# EAGLE schematic picotouch_grid_mpr (EAGLE 9.6.2)

## Sheet 1 of 3
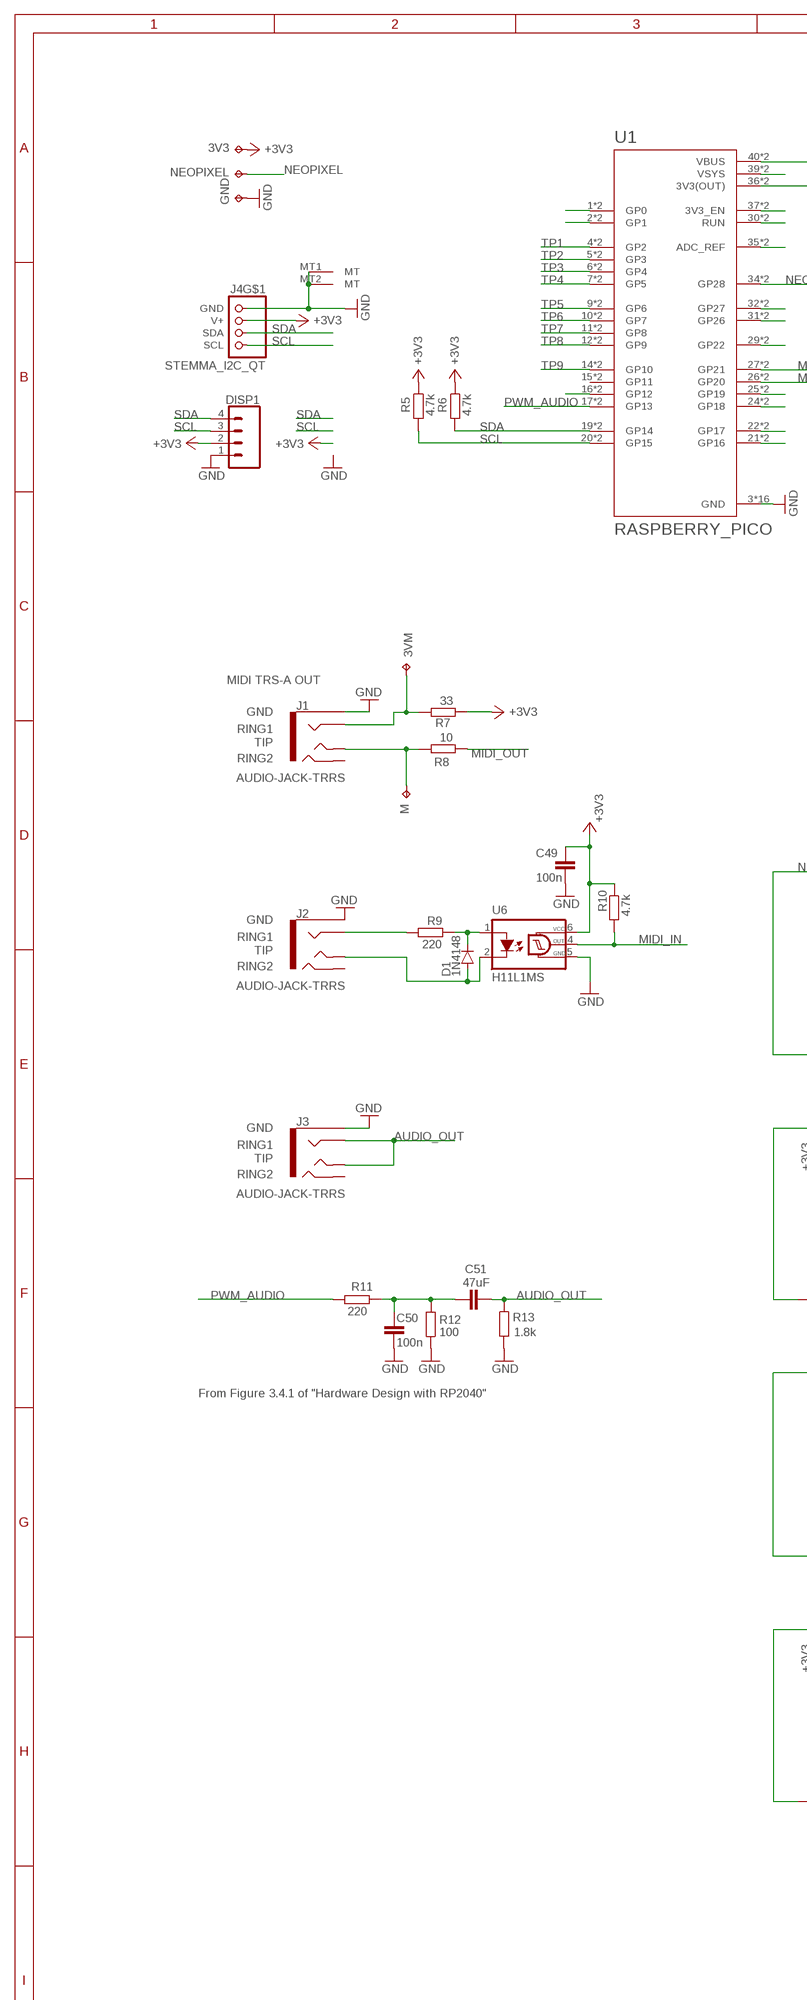
[diagram p0: schematic, sheet 1, part 1 of 2]
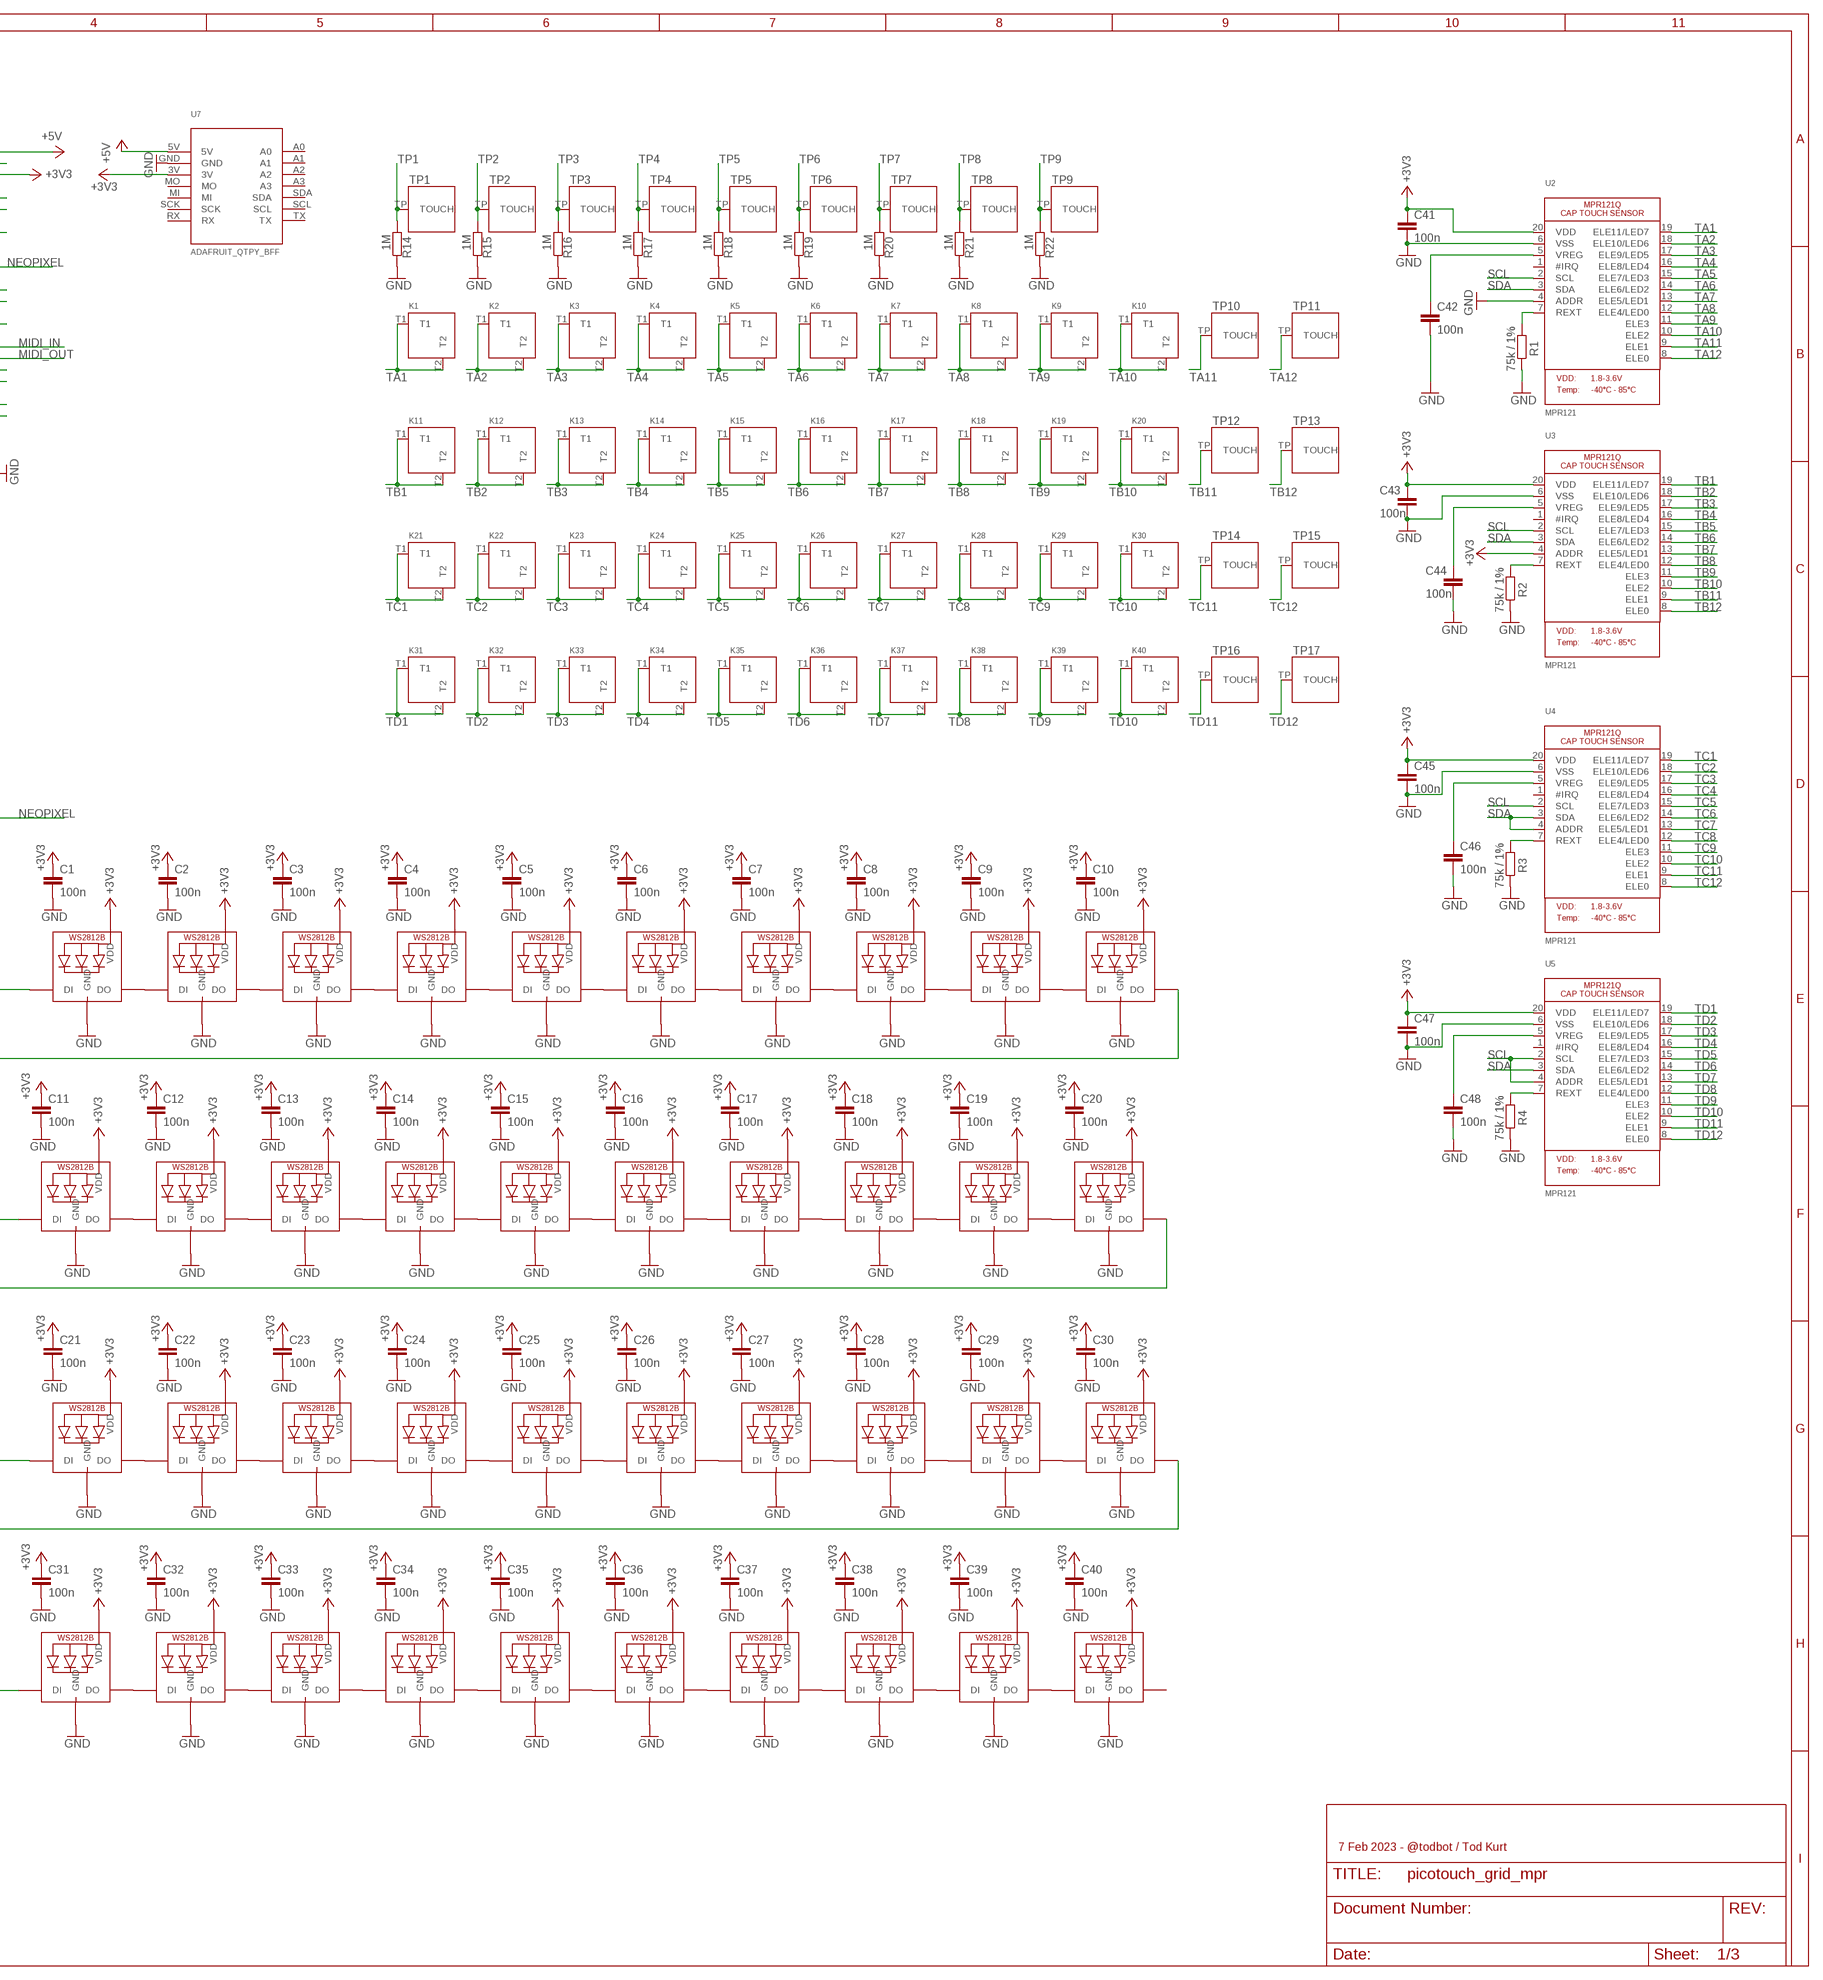
[diagram p1: schematic, sheet 1, part 2 of 2]

### Parts
3V3  TPTP15R  [TP15R]
3VM  TPTP15R  [TP15R]
C1  100n  C-EUC0603  [C0603]
C2  100n  C-EUC0603  [C0603]
C3  100n  C-EUC0603  [C0603]
C4  100n  C-EUC0603  [C0603]
C5  100n  C-EUC0603  [C0603]
C6  100n  C-EUC0603  [C0603]
C7  100n  C-EUC0603  [C0603]
C8  100n  C-EUC0603  [C0603]
C9  100n  C-EUC0603  [C0603]
C10  100n  C-EUC0603  [C0603]
C11  100n  C-EUC0603  [C0603]
C12  100n  C-EUC0603  [C0603]
C13  100n  C-EUC0603  [C0603]
C14  100n  C-EUC0603  [C0603]
C15  100n  C-EUC0603  [C0603]
C16  100n  C-EUC0603  [C0603]
C17  100n  C-EUC0603  [C0603]
C18  100n  C-EUC0603  [C0603]
C19  100n  C-EUC0603  [C0603]
C20  100n  C-EUC0603  [C0603]
C21  100n  C-EUC0603  [C0603]
C22  100n  C-EUC0603  [C0603]
C23  100n  C-EUC0603  [C0603]
C24  100n  C-EUC0603  [C0603]
C25  100n  C-EUC0603  [C0603]
C26  100n  C-EUC0603  [C0603]
C27  100n  C-EUC0603  [C0603]
C28  100n  C-EUC0603  [C0603]
C29  100n  C-EUC0603  [C0603]
C30  100n  C-EUC0603  [C0603]
C31  100n  C-EUC0603  [C0603]
C32  100n  C-EUC0603  [C0603]
C33  100n  C-EUC0603  [C0603]
C34  100n  C-EUC0603  [C0603]
C35  100n  C-EUC0603  [C0603]
C36  100n  C-EUC0603  [C0603]
C37  100n  C-EUC0603  [C0603]
C38  100n  C-EUC0603  [C0603]
C39  100n  C-EUC0603  [C0603]
C40  100n  C-EUC0603  [C0603]
C41  100n  C-EUC0603  [C0603]
C42  100n  C-EUC0603  [C0603]
C43  100n  C-EUC0603  [C0603]
C44  100n  C-EUC0603  [C0603]
C45  100n  C-EUC0603  [C0603]
C46  100n  C-EUC0603  [C0603]
C47  100n  C-EUC0603  [C0603]
C48  100n  C-EUC0603  [C0603]
C49  100n  C-EUC0603  [C0603]
C50  100n  C-EUC0603  [C0603]
C51  47uF  C-EUC0805  [C0805]
D1  1N4148  DIODE-SOD123  [SOD123]
DISP1  CONN_04  [1X04]
GND  TPTP15R  [TP15R]
J1  AUDIO-JACK-TRRS  [PJ-320D_SPARKFUN]
J2  AUDIO-JACK-TRRS  [PJ-320D_SPARKFUN]
J3  AUDIO-JACK-TRRS  [PJ-320D_SPARKFUN]
J4  STEMMA_I2C_QT  [JST_SH4]
K1  TOUCHKEYH  [TOUCHPAD_KEY_0.5IN_LEDHOLE]
K2  TOUCHKEYH  [TOUCHPAD_KEY_0.5IN_LEDHOLE]
K3  TOUCHKEYH  [TOUCHPAD_KEY_0.5IN_LEDHOLE]
K4  TOUCHKEYH  [TOUCHPAD_KEY_0.5IN_LEDHOLE]
K5  TOUCHKEYH  [TOUCHPAD_KEY_0.5IN_LEDHOLE]
K6  TOUCHKEYH  [TOUCHPAD_KEY_0.5IN_LEDHOLE]
K7  TOUCHKEYH  [TOUCHPAD_KEY_0.5IN_LEDHOLE]
K8  TOUCHKEYH  [TOUCHPAD_KEY_0.5IN_LEDHOLE]
K9  TOUCHKEYH  [TOUCHPAD_KEY_0.5IN_LEDHOLE]
K10  TOUCHKEYH  [TOUCHPAD_KEY_0.5IN_LEDHOLE]
K11  TOUCHKEYH  [TOUCHPAD_KEY_0.5IN_LEDHOLE]
K12  TOUCHKEYH  [TOUCHPAD_KEY_0.5IN_LEDHOLE]
K13  TOUCHKEYH  [TOUCHPAD_KEY_0.5IN_LEDHOLE]
K14  TOUCHKEYH  [TOUCHPAD_KEY_0.5IN_LEDHOLE]
K15  TOUCHKEYH  [TOUCHPAD_KEY_0.5IN_LEDHOLE]
K16  TOUCHKEYH  [TOUCHPAD_KEY_0.5IN_LEDHOLE]
K17  TOUCHKEYH  [TOUCHPAD_KEY_0.5IN_LEDHOLE]
K18  TOUCHKEYH  [TOUCHPAD_KEY_0.5IN_LEDHOLE]
K19  TOUCHKEYH  [TOUCHPAD_KEY_0.5IN_LEDHOLE]
K20  TOUCHKEYH  [TOUCHPAD_KEY_0.5IN_LEDHOLE]
K21  TOUCHKEYH  [TOUCHPAD_KEY_0.5IN_LEDHOLE]
K22  TOUCHKEYH  [TOUCHPAD_KEY_0.5IN_LEDHOLE]
K23  TOUCHKEYH  [TOUCHPAD_KEY_0.5IN_LEDHOLE]
K24  TOUCHKEYH  [TOUCHPAD_KEY_0.5IN_LEDHOLE]
K25  TOUCHKEYH  [TOUCHPAD_KEY_0.5IN_LEDHOLE]
K26  TOUCHKEYH  [TOUCHPAD_KEY_0.5IN_LEDHOLE]
K27  TOUCHKEYH  [TOUCHPAD_KEY_0.5IN_LEDHOLE]
K28  TOUCHKEYH  [TOUCHPAD_KEY_0.5IN_LEDHOLE]
K29  TOUCHKEYH  [TOUCHPAD_KEY_0.5IN_LEDHOLE]
K30  TOUCHKEYH  [TOUCHPAD_KEY_0.5IN_LEDHOLE]
K31  TOUCHKEYH  [TOUCHPAD_KEY_0.5IN_LEDHOLE]
K32  TOUCHKEYH  [TOUCHPAD_KEY_0.5IN_LEDHOLE]
K33  TOUCHKEYH  [TOUCHPAD_KEY_0.5IN_LEDHOLE]
K34  TOUCHKEYH  [TOUCHPAD_KEY_0.5IN_LEDHOLE]
K35  TOUCHKEYH  [TOUCHPAD_KEY_0.5IN_LEDHOLE]
K36  TOUCHKEYH  [TOUCHPAD_KEY_0.5IN_LEDHOLE]
K37  TOUCHKEYH  [TOUCHPAD_KEY_0.5IN_LEDHOLE]
K38  TOUCHKEYH  [TOUCHPAD_KEY_0.5IN_LEDHOLE]
K39  TOUCHKEYH  [TOUCHPAD_KEY_0.5IN_LEDHOLE]
K40  TOUCHKEYH  [TOUCHPAD_KEY_0.5IN_LEDHOLE]
LED1  MICROBUILDER_WS2812B_SK6812E  [MICROBUILDER_NEO3535_REVERSE]
LED2  MICROBUILDER_WS2812B_SK6812E  [MICROBUILDER_NEO3535_REVERSE]
LED3  MICROBUILDER_WS2812B_SK6812E  [MICROBUILDER_NEO3535_REVERSE]
LED4  MICROBUILDER_WS2812B_SK6812E  [MICROBUILDER_NEO3535_REVERSE]
LED5  MICROBUILDER_WS2812B_SK6812E  [MICROBUILDER_NEO3535_REVERSE]
LED6  MICROBUILDER_WS2812B_SK6812E  [MICROBUILDER_NEO3535_REVERSE]
LED7  MICROBUILDER_WS2812B_SK6812E  [MICROBUILDER_NEO3535_REVERSE]
LED8  MICROBUILDER_WS2812B_SK6812E  [MICROBUILDER_NEO3535_REVERSE]
LED9  MICROBUILDER_WS2812B_SK6812E  [MICROBUILDER_NEO3535_REVERSE]
LED10  MICROBUILDER_WS2812B_SK6812E  [MICROBUILDER_NEO3535_REVERSE]
LED11  MICROBUILDER_WS2812B_SK6812E  [MICROBUILDER_NEO3535_REVERSE]
LED12  MICROBUILDER_WS2812B_SK6812E  [MICROBUILDER_NEO3535_REVERSE]
LED13  MICROBUILDER_WS2812B_SK6812E  [MICROBUILDER_NEO3535_REVERSE]
LED14  MICROBUILDER_WS2812B_SK6812E  [MICROBUILDER_NEO3535_REVERSE]
LED15  MICROBUILDER_WS2812B_SK6812E  [MICROBUILDER_NEO3535_REVERSE]
LED16  MICROBUILDER_WS2812B_SK6812E  [MICROBUILDER_NEO3535_REVERSE]
LED17  MICROBUILDER_WS2812B_SK6812E  [MICROBUILDER_NEO3535_REVERSE]
LED18  MICROBUILDER_WS2812B_SK6812E  [MICROBUILDER_NEO3535_REVERSE]
LED19  MICROBUILDER_WS2812B_SK6812E  [MICROBUILDER_NEO3535_REVERSE]
LED20  MICROBUILDER_WS2812B_SK6812E  [MICROBUILDER_NEO3535_REVERSE]
LED21  MICROBUILDER_WS2812B_SK6812E  [MICROBUILDER_NEO3535_REVERSE]
LED22  MICROBUILDER_WS2812B_SK6812E  [MICROBUILDER_NEO3535_REVERSE]
LED23  MICROBUILDER_WS2812B_SK6812E  [MICROBUILDER_NEO3535_REVERSE]
LED24  MICROBUILDER_WS2812B_SK6812E  [MICROBUILDER_NEO3535_REVERSE]
LED25  MICROBUILDER_WS2812B_SK6812E  [MICROBUILDER_NEO3535_REVERSE]
LED26  MICROBUILDER_WS2812B_SK6812E  [MICROBUILDER_NEO3535_REVERSE]
LED27  MICROBUILDER_WS2812B_SK6812E  [MICROBUILDER_NEO3535_REVERSE]
LED28  MICROBUILDER_WS2812B_SK6812E  [MICROBUILDER_NEO3535_REVERSE]
LED29  MICROBUILDER_WS2812B_SK6812E  [MICROBUILDER_NEO3535_REVERSE]
LED30  MICROBUILDER_WS2812B_SK6812E  [MICROBUILDER_NEO3535_REVERSE]
LED31  MICROBUILDER_WS2812B_SK6812E  [MICROBUILDER_NEO3535_REVERSE]
LED32  MICROBUILDER_WS2812B_SK6812E  [MICROBUILDER_NEO3535_REVERSE]
LED33  MICROBUILDER_WS2812B_SK6812E  [MICROBUILDER_NEO3535_REVERSE]
LED34  MICROBUILDER_WS2812B_SK6812E  [MICROBUILDER_NEO3535_REVERSE]
LED35  MICROBUILDER_WS2812B_SK6812E  [MICROBUILDER_NEO3535_REVERSE]
LED36  MICROBUILDER_WS2812B_SK6812E  [MICROBUILDER_NEO3535_REVERSE]
LED37  MICROBUILDER_WS2812B_SK6812E  [MICROBUILDER_NEO3535_REVERSE]
LED38  MICROBUILDER_WS2812B_SK6812E  [MICROBUILDER_NEO3535_REVERSE]
LED39  MICROBUILDER_WS2812B_SK6812E  [MICROBUILDER_NEO3535_REVERSE]
LED40  MICROBUILDER_WS2812B_SK6812E  [MICROBUILDER_NEO3535_REVERSE]
M  TPTP15R  [TP15R]
NEOPIXEL  TPTP15R  [TP15R]
R1  75k / 1%  R-EU_R0603  [R0603]
R2  75k / 1%  R-EU_R0603  [R0603]
R3  75k / 1%  R-EU_R0603  [R0603]
R4  75k / 1%  R-EU_R0603  [R0603]
R5  4.7k  R-EU_R0603  [R0603]
R6  4.7k  R-EU_R0603  [R0603]
R7  33  R-EU_R0603  [R0603]
R8  10  R-EU_R0603  [R0603]
R9  220  R-EU_R0603  [R0603]
R10  4.7k  R-EU_R0603  [R0603]
R11  220  R-EU_R0603  [R0603]
R12  100  R-EU_R0603  [R0603]
R13  1.8k  R-EU_R0603  [R0603]
R14  1M  R-EU_R0603  [R0603]
R15  1M  R-EU_R0603  [R0603]
R16  1M  R-EU_R0603  [R0603]
R17  1M  R-EU_R0603  [R0603]
R18  1M  R-EU_R0603  [R0603]
R19  1M  R-EU_R0603  [R0603]
R20  1M  R-EU_R0603  [R0603]
R21  1M  R-EU_R0603  [R0603]
R22  1M  R-EU_R0603  [R0603]
TP1  TOUCHPADB  [TOUCHPADB]
TP2  TOUCHPADB  [TOUCHPADB]
TP3  TOUCHPADB  [TOUCHPADB]
TP4  TOUCHPADB  [TOUCHPADB]
TP5  TOUCHPADB  [TOUCHPADB]
TP6  TOUCHPADB  [TOUCHPADB]
TP7  TOUCHPADB  [TOUCHPADB]
TP8  TOUCHPADB  [TOUCHPADB]
TP9  TOUCHPADB  [TOUCHPADB]
TP10  TOUCHPADB  [TOUCHPADB]
TP11  TOUCHPADB  [TOUCHPADB]
TP12  TOUCHPADB  [TOUCHPADB]
TP13  TOUCHPADB  [TOUCHPADB]
TP14  TOUCHPADB  [TOUCHPADB]
TP15  TOUCHPADB  [TOUCHPADB]
TP16  TOUCHPADB  [TOUCHPADB]
TP17  TOUCHPADB  [TOUCHPADB]
U1  RASPBERRY_PICO  [PICO-PKG-DUALSMD]
U2  MPR121  MPR121Q  [QFN20_3MM_NOTHERMAL]
U3  MPR121  MPR121Q  [QFN20_3MM_NOTHERMAL]
U4  MPR121  MPR121Q  [QFN20_3MM_NOTHERMAL]
U5  MPR121  MPR121Q  [QFN20_3MM_NOTHERMAL]
U6  H11L1MS  [DIL6-SMD]
U7  ADAFRUIT_QTPY_BFF  [ADAFRUIT_QTPY_BFF_LIPO]

### Nets
+3V3: 3V3.TP C1.1 C2.1 C3.1 C4.1 C5.1 C6.1 C7.1 C8.1 C9.1 C10.1 C11.1 C12.1 C13.1 C14.1 C15.1 C16.1 C17.1 C18.1 C19.1 C20.1 C21.1 C22.1 C23.1 C24.1 C25.1 C26.1 C27.1 C28.1 C29.1 C30.1 C31.1 C32.1 C33.1 C34.1 C35.1 C36.1 C37.1 C38.1 C39.1 C40.1 C41.1 C43.1 C45.1 C47.1 C49.1 DISP1.2 J4.2(V+) LED1.1-VDD(VDD) LED2.1-VDD(VDD) LED3.1-VDD(VDD) LED4.1-VDD(VDD) LED5.1-VDD(VDD) LED6.1-VDD(VDD) LED7.1-VDD(VDD) LED8.1-VDD(VDD) LED9.1-VDD(VDD) LED10.1-VDD(VDD) LED11.1-VDD(VDD) LED12.1-VDD(VDD) LED13.1-VDD(VDD) LED14.1-VDD(VDD) LED15.1-VDD(VDD) LED16.1-VDD(VDD) LED17.1-VDD(VDD) LED18.1-VDD(VDD) LED19.1-VDD(VDD) LED20.1-VDD(VDD) LED21.1-VDD(VDD) LED22.1-VDD(VDD) LED23.1-VDD(VDD) LED24.1-VDD(VDD) LED25.1-VDD(VDD) LED26.1-VDD(VDD) LED27.1-VDD(VDD) LED28.1-VDD(VDD) LED29.1-VDD(VDD) LED30.1-VDD(VDD) LED31.1-VDD(VDD) LED32.1-VDD(VDD) LED33.1-VDD(VDD) LED34.1-VDD(VDD) LED35.1-VDD(VDD) LED36.1-VDD(VDD) LED37.1-VDD(VDD) LED38.1-VDD(VDD) LED39.1-VDD(VDD) LED40.1-VDD(VDD) R5.1 R6.1 R7.2 R10.1 U1.36'(3V3(OUT)) U1.36(3V3(OUT)) U2.20(VDD) U3.4(ADDR) U3.20(VDD) U4.20(VDD) U5.20(VDD) U6.6(VCC) U7.3V
+5V: U1.40'(VBUS) U1.40(VBUS) U7.5V
AUDIO_OUT: C51.2 J3.RING1 J3.TIP R13.1
GND: C1.2 C2.2 C3.2 C4.2 C5.2 C6.2 C7.2 C8.2 C9.2 C10.2 C11.2 C12.2 C13.2 C14.2 C15.2 C16.2 C17.2 C18.2 C19.2 C20.2 C21.2 C22.2 C23.2 C24.2 C25.2 C26.2 C27.2 C28.2 C29.2 C30.2 C31.2 C32.2 C33.2 C34.2 C35.2 C36.2 C37.2 C38.2 C39.2 C40.2 C41.2 C42.2 C43.2 C44.2 C45.2 C46.2 C47.2 C48.2 C49.2 C50.2 DISP1.1 GND.TP J1.EARTH J2.EARTH J3.EARTH J4.1(GND) J4.MT1(MT) J4.MT2(MT) LED1.3-GND(GND) LED2.3-GND(GND) LED3.3-GND(GND) LED4.3-GND(GND) LED5.3-GND(GND) LED6.3-GND(GND) LED7.3-GND(GND) LED8.3-GND(GND) LED9.3-GND(GND) LED10.3-GND(GND) LED11.3-GND(GND) LED12.3-GND(GND) LED13.3-GND(GND) LED14.3-GND(GND) LED15.3-GND(GND) LED16.3-GND(GND) LED17.3-GND(GND) LED18.3-GND(GND) LED19.3-GND(GND) LED20.3-GND(GND) LED21.3-GND(GND) LED22.3-GND(GND) LED23.3-GND(GND) LED24.3-GND(GND) LED25.3-GND(GND) LED26.3-GND(GND) LED27.3-GND(GND) LED28.3-GND(GND) LED29.3-GND(GND) LED30.3-GND(GND) LED31.3-GND(GND) LED32.3-GND(GND) LED33.3-GND(GND) LED34.3-GND(GND) LED35.3-GND(GND) LED36.3-GND(GND) LED37.3-GND(GND) LED38.3-GND(GND) LED39.3-GND(GND) LED40.3-GND(GND) R1.1 R2.1 R3.1 R4.1 R12.1 R13.2 R14.1 R15.1 R16.1 R17.1 R18.1 R19.1 R20.1 R21.1 R22.1 U1.3'(GND) U1.3(GND) U1.8'(GND) U1.8(GND) U1.13'(GND) U1.13(GND) U1.18'(GND) U1.18(GND) U1.23'(GND) U1.23(GND) U1.28'(GND) U1.28(GND) U1.33'(GND) U1.33(GND) U1.38'(GND) U1.38(GND) U2.4(ADDR) U2.6(VSS) U3.6(VSS) U4.6(VSS) U5.6(VSS) U6.5(GND) U7.GND
MIDI_IN: R10.2 U1.27'(GP21) U1.27(GP21) U6.4(OUT)
MIDI_OUT: R8.2 U1.26'(GP20) U1.26(GP20)
N$1: LED1.2-DOUT(DO) LED2.4-DIN(DI)
N$2: LED2.2-DOUT(DO) LED3.4-DIN(DI)
N$3: LED4.2-DOUT(DO) LED5.4-DIN(DI)
N$4: LED5.2-DOUT(DO) LED6.4-DIN(DI)
N$5: LED3.2-DOUT(DO) LED4.4-DIN(DI)
N$6: LED7.2-DOUT(DO) LED8.4-DIN(DI)
N$7: LED8.2-DOUT(DO) LED9.4-DIN(DI)
N$8: J1.TIP M.TP R8.1
N$9: LED11.2-DOUT(DO) LED12.4-DIN(DI)
N$10: LED9.2-DOUT(DO) LED10.4-DIN(DI)
N$11: LED6.2-DOUT(DO) LED7.4-DIN(DI)
N$12: LED14.2-DOUT(DO) LED15.4-DIN(DI)
N$13: LED15.2-DOUT(DO) LED16.4-DIN(DI)
N$14: LED13.2-DOUT(DO) LED14.4-DIN(DI)
N$15: LED17.2-DOUT(DO) LED18.4-DIN(DI)
N$16: LED18.2-DOUT(DO) LED19.4-DIN(DI)
N$17: LED19.2-DOUT(DO) LED20.4-DIN(DI)
N$18: LED16.2-DOUT(DO) LED17.4-DIN(DI)
N$19: LED12.2-DOUT(DO) LED13.4-DIN(DI)
N$20: LED21.2-DOUT(DO) LED22.4-DIN(DI)
N$21: LED22.2-DOUT(DO) LED23.4-DIN(DI)
N$22: LED24.2-DOUT(DO) LED25.4-DIN(DI)
N$23: LED25.2-DOUT(DO) LED26.4-DIN(DI)
N$24: LED23.2-DOUT(DO) LED24.4-DIN(DI)
N$25: LED27.2-DOUT(DO) LED28.4-DIN(DI)
N$26: LED28.2-DOUT(DO) LED29.4-DIN(DI)
N$27: LED31.2-DOUT(DO) LED32.4-DIN(DI)
N$28: LED29.2-DOUT(DO) LED30.4-DIN(DI)
N$29: LED26.2-DOUT(DO) LED27.4-DIN(DI)
N$30: LED34.2-DOUT(DO) LED35.4-DIN(DI)
N$31: LED35.2-DOUT(DO) LED36.4-DIN(DI)
N$32: LED33.2-DOUT(DO) LED34.4-DIN(DI)
N$33: LED37.2-DOUT(DO) LED38.4-DIN(DI)
N$34: LED38.2-DOUT(DO) LED39.4-DIN(DI)
N$35: LED39.2-DOUT(DO) LED40.4-DIN(DI)
N$36: LED36.2-DOUT(DO) LED37.4-DIN(DI)
N$37: LED32.2-DOUT(DO) LED33.4-DIN(DI)
N$38: 3VM.TP J1.RING1 R7.1
N$39: U1.21'(GP16) U1.21(GP16)
N$40: U1.22'(GP17) U1.22(GP17)
N$41: U1.24'(GP18) U1.24(GP18)
N$42: U1.25'(GP19) U1.25(GP19)
N$43: R2.2 U3.7(REXT)
N$44: C44.1 U3.5(VREG)
N$45: U1.32'(GP27) U1.32(GP27)
N$47: D1.C R9.1 U6.1(A)
N$48: D1.A J2.TIP U6.2(C)
N$49: J2.RING1 R9.2
N$50: R4.2 U5.7(REXT)
N$51: C48.1 U5.5(VREG)
N$53: U1.31'(GP26) U1.31(GP26)
N$54: U1.29'(GP22) U1.29(GP22)
N$55: U1.35'(ADC_REF) U1.35(ADC_REF)
N$56: U1.30'(RUN) U1.30(RUN)
N$57: C50.1 C51.1 R11.1 R12.2
N$58: U1.37'(3V3_EN) U1.37(3V3_EN)
N$61: U1.2'(GP1) U1.2(GP1)
N$62: R3.2 U4.7(REXT)
N$63: C46.1 U4.5(VREG)
N$64: U1.1'(GP0) U1.1(GP0)
N$66: U1.39'(VSYS) U1.39(VSYS)
N$67: U1.16'(GP12) U1.16(GP12)
N$114: C42.1 U2.5(VREG)
N$115: R1.2 U2.7(REXT)
NEOPIXEL: LED1.4-DIN(DI) NEOPIXEL.TP U1.34'(GP28) U1.34(GP28)
NEOPIXEL0: LED10.2-DOUT(DO) LED11.4-DIN(DI)
NEOPIXEL1: LED20.2-DOUT(DO) LED21.4-DIN(DI)
NEOPIXEL2: LED30.2-DOUT(DO) LED31.4-DIN(DI)
PWM_AUDIO: R11.2 U1.17'(GP13) U1.17(GP13)
SCL: DISP1.3 J4.4(SCL) R5.2 U1.20'(GP15) U1.20(GP15) U2.2(SCL) U3.2(SCL) U4.2(SCL) U5.2(SCL) U5.4(ADDR)
SDA: DISP1.4 J4.3(SDA) R6.2 U1.19'(GP14) U1.19(GP14) U2.3(SDA) U3.3(SDA) U4.3(SDA) U4.4(ADDR) U5.3(SDA)
TA1: K1.T1 K1.T2 U2.19(ELE11/LED7)
TA2: K2.T1 K2.T2 U2.18(ELE10/LED6)
TA3: K3.T1 K3.T2 U2.17(ELE9/LED5)
TA4: K4.T1 K4.T2 U2.16(ELE8/LED4)
TA5: K5.T1 K5.T2 U2.15(ELE7/LED3)
TA6: K6.T1 K6.T2 U2.14(ELE6/LED2)
TA7: K7.T1 K7.T2 U2.13(ELE5/LED1)
TA8: K8.T1 K8.T2 U2.12(ELE4/LED0)
TA9: K9.T1 K9.T2 U2.11(ELE3)
TA10: K10.T1 K10.T2 U2.10(ELE2)
TA11: TP10.TP(TOUCH) U2.9(ELE1)
TA12: TP11.TP(TOUCH) U2.8(ELE0)
TB1: K11.T1 K11.T2 U3.19(ELE11/LED7)
TB2: K12.T1 K12.T2 U3.18(ELE10/LED6)
TB3: K13.T1 K13.T2 U3.17(ELE9/LED5)
TB4: K14.T1 K14.T2 U3.16(ELE8/LED4)
TB5: K15.T1 K15.T2 U3.15(ELE7/LED3)
TB6: K16.T1 K16.T2 U3.14(ELE6/LED2)
TB7: K17.T1 K17.T2 U3.13(ELE5/LED1)
TB8: K18.T1 K18.T2 U3.12(ELE4/LED0)
TB9: K19.T1 K19.T2 U3.11(ELE3)
TB10: K20.T1 K20.T2 U3.10(ELE2)
TB11: TP12.TP(TOUCH) U3.9(ELE1)
TB12: TP13.TP(TOUCH) U3.8(ELE0)
TC1: K21.T1 K21.T2 U4.19(ELE11/LED7)
TC2: K22.T1 K22.T2 U4.18(ELE10/LED6)
TC3: K23.T1 K23.T2 U4.17(ELE9/LED5)
TC4: K24.T1 K24.T2 U4.16(ELE8/LED4)
TC5: K25.T1 K25.T2 U4.15(ELE7/LED3)
TC6: K26.T1 K26.T2 U4.14(ELE6/LED2)
TC7: K27.T1 K27.T2 U4.13(ELE5/LED1)
TC8: K28.T1 K28.T2 U4.12(ELE4/LED0)
TC9: K29.T1 K29.T2 U4.11(ELE3)
TC10: K30.T1 K30.T2 U4.10(ELE2)
TC11: TP14.TP(TOUCH) U4.9(ELE1)
TC12: TP15.TP(TOUCH) U4.8(ELE0)
TD1: K31.T1 K31.T2 U5.19(ELE11/LED7)
TD2: K32.T1 K32.T2 U5.18(ELE10/LED6)
TD3: K33.T1 K33.T2 U5.17(ELE9/LED5)
TD4: K34.T1 K34.T2 U5.16(ELE8/LED4)
TD5: K35.T1 K35.T2 U5.15(ELE7/LED3)
TD6: K36.T1 K36.T2 U5.14(ELE6/LED2)
TD7: K37.T1 K37.T2 U5.13(ELE5/LED1)
TD8: K38.T1 K38.T2 U5.12(ELE4/LED0)
TD9: K39.T1 K39.T2 U5.11(ELE3)
TD10: K40.T1 K40.T2 U5.10(ELE2)
TD11: TP16.TP(TOUCH) U5.9(ELE1)
TD12: TP17.TP(TOUCH) U5.8(ELE0)
TP1: R14.2 TP1.TP(TOUCH) U1.4'(GP2) U1.4(GP2)
TP2: R15.2 TP2.TP(TOUCH) U1.5'(GP3) U1.5(GP3)
TP3: R16.2 TP3.TP(TOUCH) U1.6'(GP4) U1.6(GP4)
TP4: R17.2 TP4.TP(TOUCH) U1.7'(GP5) U1.7(GP5)
TP5: R18.2 TP5.TP(TOUCH) U1.9'(GP6) U1.9(GP6)
TP6: R19.2 TP6.TP(TOUCH) U1.10'(GP7) U1.10(GP7)
TP7: R20.2 TP7.TP(TOUCH) U1.11'(GP8) U1.11(GP8)
TP8: R21.2 TP8.TP(TOUCH) U1.12'(GP9) U1.12(GP9)
TP9: R22.2 TP9.TP(TOUCH) U1.14'(GP10) U1.14(GP10)
Unconnected: J1.RING2 J2.RING2 J3.RING2 LED40.2-DOUT(DO) U1.15'(GP11) U1.15(GP11) U2.1(#IRQ) U3.1(#IRQ) U4.1(#IRQ) U5.1(#IRQ) U7.A0 U7.A1 U7.A2 U7.A3 U7.MI U7.MO U7.RX U7.SCK U7.SCL U7.SDA U7.TX

### Notes on the sheet
- MIDI TRS-A OUT
- GND
- RING1
- TIP
- RING2
- GND
- RING1
- TIP
- RING2
- GND
- RING1
- TIP
- RING2
- From Figure 3.4.1 of "Hardware Design with RP2040"
- 7 Feb 2023 - @todbot / Tod Kurt

## Sheet 2 of 3

## Sheet 3 of 3

## Library data of the parts
3V3 3VM GND M NEOPIXEL = testpad:TP: Test pad
C1-C51 = rcl:C-EU: CAPACITOR, European symbol; SPICEPREFIX: C
D1 = diode:DIODE-: DIODE
DISP1 = SparkFun-Connectors:CONN_04: Multi connection point. Often used as Generic Header-pin footprint for 0.1 inch spaced/style header connections On any of the 0.1 inch spaced packages, you can populate with these: Break Away Headers - Straight <https://www.sparkfun.com/products/116> (PRT-00116) Break Away Male Headers - Right Angle <https://www.sparkfun.com/products/553> (PRT-00553) Female Headers <https://www.sparkfun.com/products/115> (PRT-00115) Break Away Headers - Machine Pin <https://www.sparkfun.com/products/117> (PRT-00117) Break Away Female Headers - Swiss Machine Pin <https://www.sparkfun.com/products/743> (PRT-00743) For SCREWTERMINALS and SPRING TERMINALS visit here: Screw Terimnals on SparkFun.com <https://www.sparkfun.com/search/results?term=Screw+Terminals> (5mm/3.5mm/2.54mm spacing) This device is also useful as a general connection point to wire up your design to another part of your project. Our various solder wires solder well into these plated through hole pads. Hook-Up Wire - Assortment (Stranded, 22 AWG) <https://www.sparkfun.com/products/11375> (PRT-11375) Hook-Up Wire - Assortment (Solid Core, 22 AWG) <https://www.sparkfun.com/products/11367> (PRT-11367) View the entire wire category on our website here <https://www.sparkfun.com/categories/141> Special notes: Molex polarized connector foot print use with SKU : PRT-08231 with associated crimp pins and housings. 1MM SMD Version SKU: PRT-10208; PROD_ID: CONN-09696
J1-J3 = audio_jacks_todbot:AUDIO-JACK-TRRS; LCSC: C431535; MPN: PJ-320D
J4 = adafruit_electromech:STEMMA_I2C; LCSC: C2845363; LCSC2: C160404; MPN: HC-1.0-4PWT; MPN2: SM04B-SRSS-TB
K1-K40 = todstuff2023:TOUCHKEY
LED1 = Adafruit MacroPad 2040:MICROBUILDER_WS2812B; LCSC: C5149201
LED2-LED40 = Adafruit MacroPad 2040:MICROBUILDER_WS2812B
R1-R22 = rcl:R-EU_: RESISTOR, European symbol; SPICEPREFIX: R
TP1-TP17 = todstuff2023:TOUCHPAD
U1 = RpiPico:RASPBERRY_PICO: Raspberry Pi Pico
U2-U5 = microbuilder:MPR121Q: MPR121Q - 12 Electrode Cap Touch Sensor Can drive up to 8 LEDs; LCSC: C91322
U6 = optocoupler:H11L*M: 6-Pin DIP Optocoupler Source: http://www.fairchildsemi.com/ds/H1/H11L2-M.pdf; LCSC: C78589; MPN2: H11L1S; OC_FARNELL: unknown; OC_NEWARK: unknown
U7 = todstuff2023:ADAFRUIT_QTPY_BFF